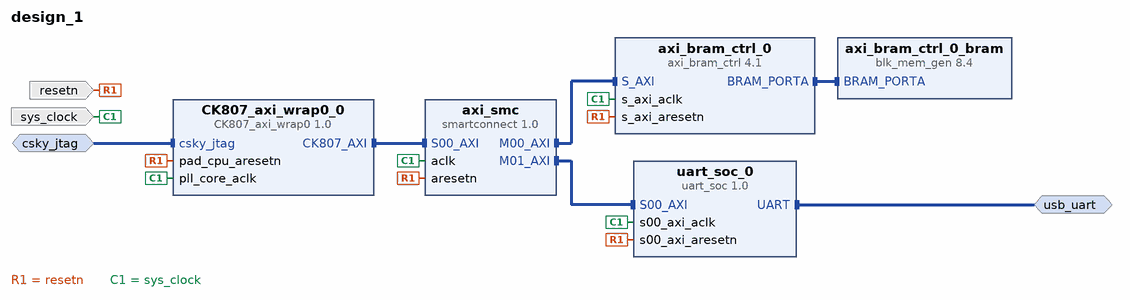
[diagram p0: block diagram of the top level]
# Vivado block design design_1, xc7a100tcsg324-1, Vivado 2022.1
create_bd_design design_1

create_bd_intf_port -mode Slave -vlnv vlsi.zju.edu.cn:user:csky_jtag_rtl:1.0 csky_jtag
create_bd_intf_port -mode Master -vlnv zju.edu.cn:user:UART_rtl:1.0 usb_uart
create_bd_port -dir I -type rst resetn
create_bd_port -dir I -type clk sys_clock

create_bd_cell -type ip -vlnv vlsi.zju.edu.cn:C-SKY:CK807_axi_wrap0:1.0 CK807_axi_wrap0_0
create_bd_cell -type ip -vlnv xilinx.com:ip:axi_bram_ctrl:4.1 axi_bram_ctrl_0
set_property -dict {CONFIG.SINGLE_PORT_BRAM 1} [get_bd_cells axi_bram_ctrl_0]
create_bd_cell -type ip -vlnv xilinx.com:ip:blk_mem_gen:8.4 axi_bram_ctrl_0_bram
set_property -dict {CONFIG.EN_SAFETY_CKT false} [get_bd_cells axi_bram_ctrl_0_bram]
create_bd_cell -type ip -vlnv xilinx.com:ip:smartconnect:1.0 axi_smc
set_property -dict {CONFIG.NUM_MI 2 CONFIG.NUM_SI 1} [get_bd_cells axi_smc]
create_bd_cell -type ip -vlnv zju.edu.cn:user:uart_soc:1.0 uart_soc_0

# ---- connections ----

connect_bd_intf_net [get_bd_intf_pins CK807_axi_wrap0_0/CK807_AXI] [get_bd_intf_pins axi_smc/S00_AXI]
connect_bd_intf_net [get_bd_intf_pins axi_bram_ctrl_0_bram/BRAM_PORTA] [get_bd_intf_pins axi_bram_ctrl_0/BRAM_PORTA]
connect_bd_intf_net [get_bd_intf_pins axi_smc/M00_AXI] [get_bd_intf_pins axi_bram_ctrl_0/S_AXI]
connect_bd_intf_net [get_bd_intf_pins axi_smc/M01_AXI] [get_bd_intf_pins uart_soc_0/S00_AXI]
connect_bd_intf_net -intf_net csky_jtag_0_1 [get_bd_intf_ports csky_jtag] [get_bd_intf_pins CK807_axi_wrap0_0/csky_jtag]
connect_bd_intf_net [get_bd_intf_ports usb_uart] [get_bd_intf_pins uart_soc_0/UART]
connect_bd_net -net pad_cpu_aresetn_0_1 [get_bd_ports resetn] \
  [get_bd_pins CK807_axi_wrap0_0/pad_cpu_aresetn] [get_bd_pins axi_bram_ctrl_0/s_axi_aresetn] [get_bd_pins axi_smc/aresetn] \
  [get_bd_pins uart_soc_0/s00_axi_aresetn]
connect_bd_net -net pll_core_aclk_0_1 [get_bd_ports sys_clock] \
  [get_bd_pins CK807_axi_wrap0_0/pll_core_aclk] [get_bd_pins axi_bram_ctrl_0/s_axi_aclk] [get_bd_pins axi_smc/aclk] \
  [get_bd_pins uart_soc_0/s00_axi_aclk]

# ---- address map ----
assign_bd_address -offset 0x44A00000 -range 64K -target_address_space [get_bd_addr_spaces CK807_axi_wrap0_0/CK807_AXI] [get_bd_addr_segs uart_soc_0/S00_AXI/S00_AXI_reg]
assign_bd_address -offset 0xC0000000 -range 8K -target_address_space [get_bd_addr_spaces CK807_axi_wrap0_0/CK807_AXI] [get_bd_addr_segs axi_bram_ctrl_0/S_AXI/Mem0]

validate_bd_design
save_bd_design
